# Altium schematic sheet Top.SchDoc
size B; SheetNumber: 1; SheetTotal: 7
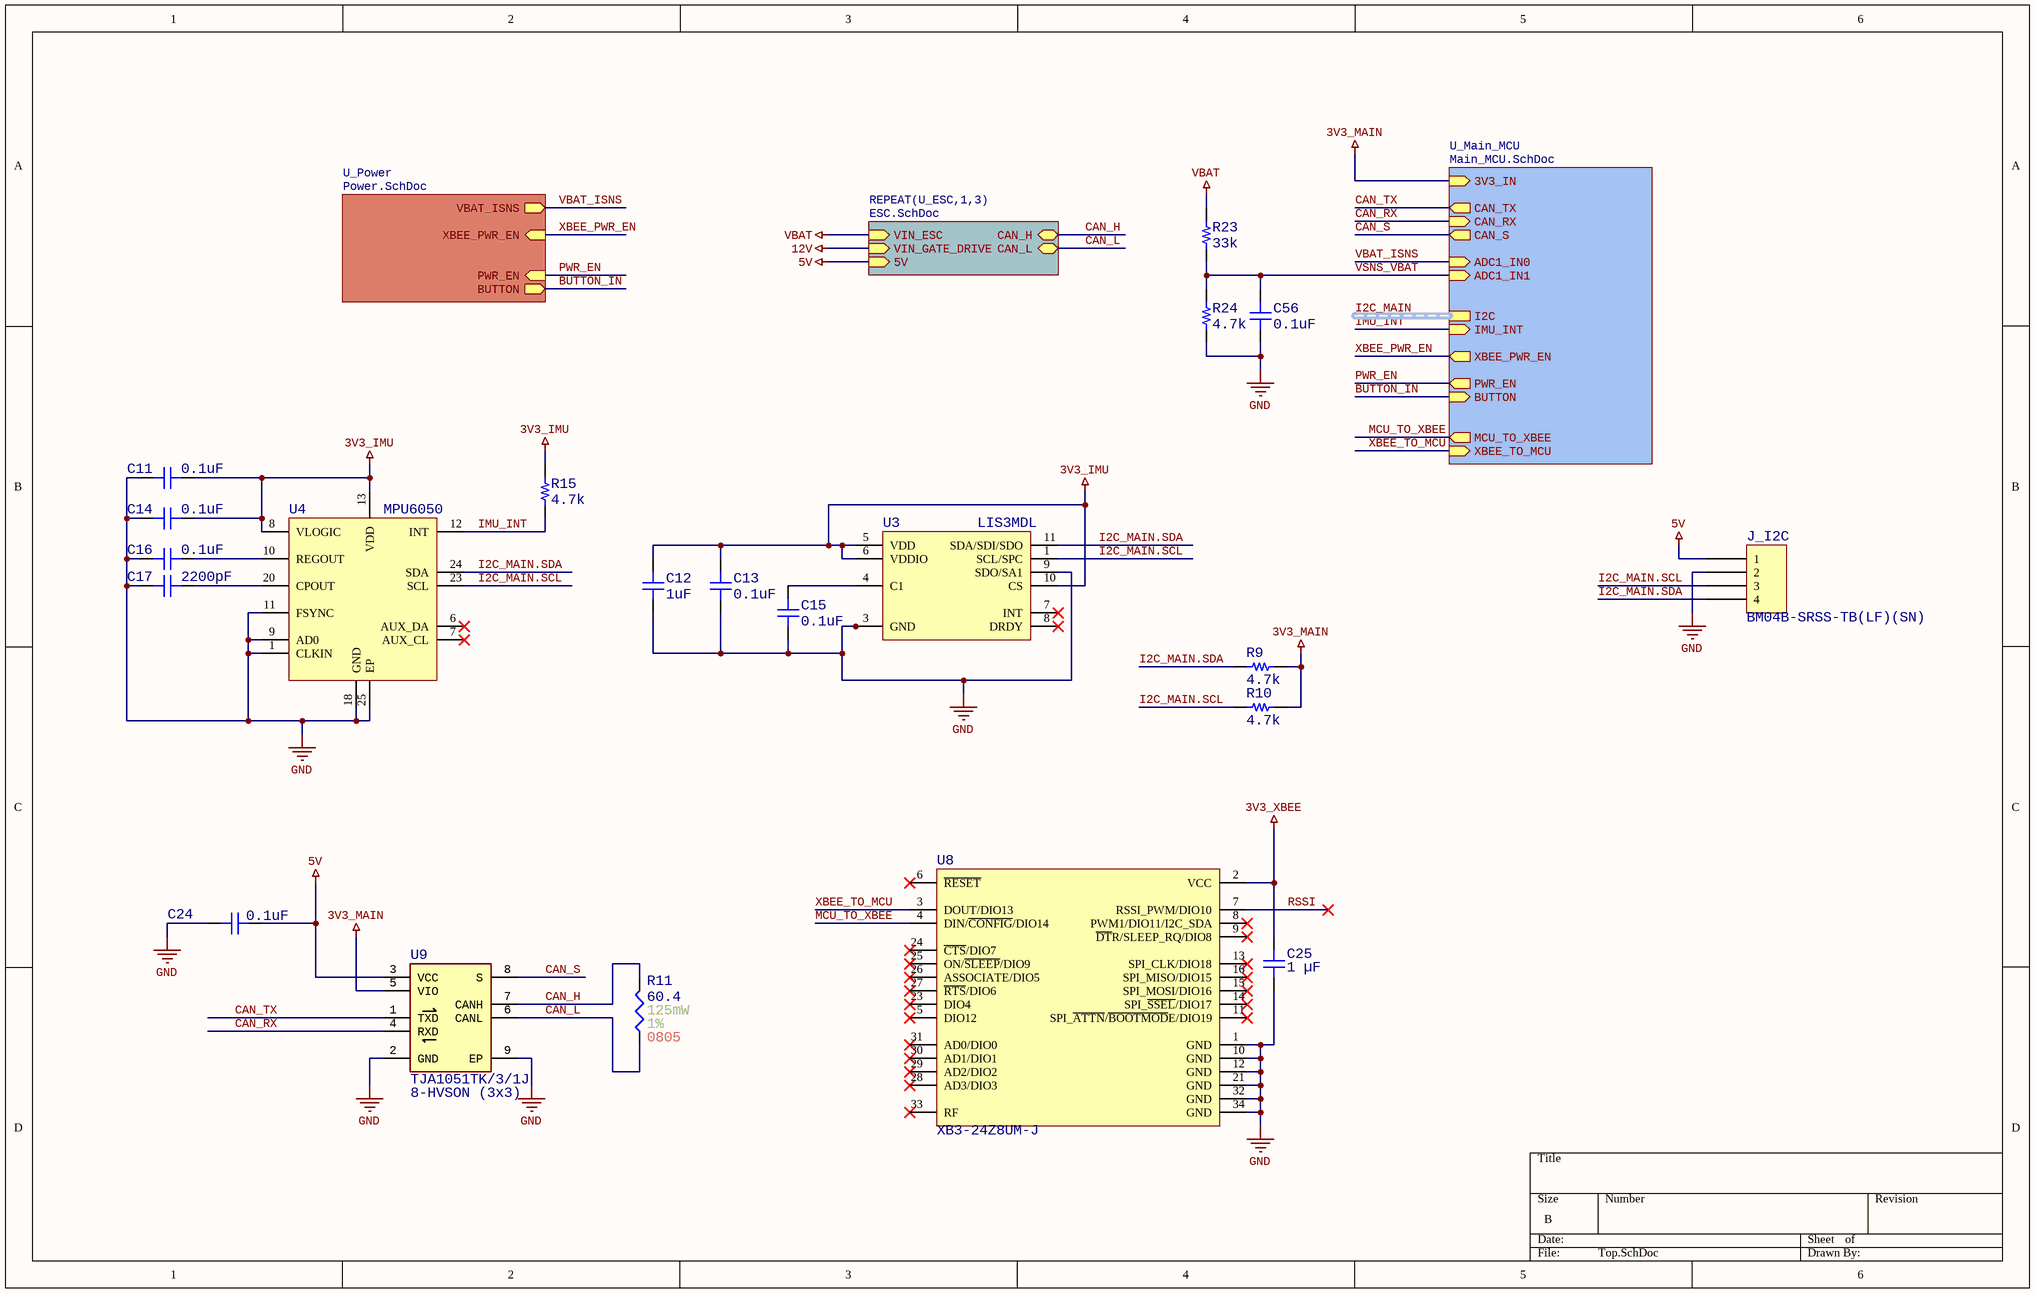
[diagram p0: Top.SchDoc]

## Parts
C11  0.1uF  [CAP_0402]
C12  1uF  [CAP_0402]
C13  0.1uF  [CAP_0402]
C14  0.1uF  [CAP_0402]
C15  0.1uF  [CAP_0402]
C16  0.1uF  [CAP_0402]
C17  2200pF  [CAP_0402]
C24  0.1uF  [CAP_0402]
C25  1 µF  [CAP 0402_1005]
C56  0.1uF  [CAP_0402]
J_I2C  BM04B-SRSS-TB(LF)(SN)  [JST BM04B-SRSS-TB]
R9  4.7k  [RES_0402]
R10  4.7k  [RES_0402]
R11  value 60.4  Power: 125mW  Tolerance: 1%  Case/Package: 0805  [0805 Resistor]  (hidden comment: TFA0805R60R4F-T5)
R15  4.7k  [RES_0402]
R23  33k  [RES_0402]
R24  4.7k  [RES_0402]
U3  LIS3MDL  [LGA12_ST]
U4  MPU6050  [IC_MPU6050]
U8  XB3-24Z8UM-J  [XCVR_XB3-24Z8UM-J]
U9  TJA1051TK/3/1J  Case/Package: 8-HVSON (3x3)  [TJA1044xxK]

## Sub-sheets
REPEAT(U_ESC,1,3) = ESC.SchDoc: CAN_H (bidir), CAN_L (bidir), VIN_ESC (in), VIN_GATE_DRIVE (in), 5V (in)
U_Main_MCU = Main_MCU.SchDoc: I2C (harness I2C), CAN_TX (out), CAN_RX (in), CAN_S (out), 3V3_IN (in), ADC1_IN0 (in), IMU_INT (in), XBEE_PWR_EN (out), PWR_EN (out), BUTTON (in), XBEE_TO_MCU (in), MCU_TO_XBEE (out), ADC1_IN1 (in)
U_Power = Power.SchDoc: XBEE_PWR_EN (in), VBAT_ISNS (out), PWR_EN (in), BUTTON (out)

## Nets
3V3_IMU: C11.1 C12.1 C13.1 C14.1 R15.1 U3.5(VDD) U3.6(VDDIO) U3.10(CS) U4.8(VLOGIC) U4.13(VDD)
3V3_MAIN: R9.1 R10.1 U9.5(VIO) ; sheet U_Main_MCU/3V3_IN
3V3_XBEE: C25.1 U8.2(VCC)
5V: C24.1 J_I2C.1 U9.3(VCC) ; sheet REPEAT(U_ESC,1,3)/5V
12V: sheet REPEAT(U_ESC,1,3)/VIN_GATE_DRIVE
GND: C11.2 C12.2 C13.2 C14.2 C15.2 C16.2 C17.2 C24.2 C25.2 C56.2 J_I2C.2 R24.2 U3.2(Reserved) U3.3(GND) U3.9(SDO/SA1) U3.12(Reserved) U4.1(CLKIN) U4.9(AD0) U4.11(FSYNC) U4.18(GND) U4.25(EP) U8.1(GND) U8.10(GND) U8.12(GND) U8.21(GND) U8.32(GND) U8.34(GND) U9.2(GND) U9.9(EP)
VBAT: R23.1 ; sheet REPEAT(U_ESC,1,3)/VIN_ESC
BUTTON_IN: sheet U_Main_MCU/BUTTON, sheet U_Power/BUTTON
CAN_H: R11.2 U9.7(CANH) ; sheet REPEAT(U_ESC,1,3)/CAN_H
CAN_L: R11.1 U9.6(CANL) ; sheet REPEAT(U_ESC,1,3)/CAN_L
CAN_RX: U9.4(RXD) ; sheet U_Main_MCU/CAN_RX
CAN_S: U9.8(S) ; sheet U_Main_MCU/CAN_S
CAN_TX: U9.1(TXD) ; sheet U_Main_MCU/CAN_TX
I2C_MAIN.SCL: J_I2C.3 R10.2 U3.1(SCL/SPC) U4.23(SCL)
I2C_MAIN.SDA: J_I2C.4 R9.2 U3.11(SDA/SDI/SDO) U4.24(SDA)
IMU_INT: R15.2 U4.12(INT) ; sheet U_Main_MCU/IMU_INT
MCU_TO_XBEE: U8.4(DIN/~{CONFIG}/DIO14) ; sheet U_Main_MCU/MCU_TO_XBEE
PWR_EN: sheet U_Main_MCU/PWR_EN, sheet U_Power/PWR_EN
RSSI: U8.7(RSSI_PWM/DIO10)
VBAT_ISNS: sheet U_Main_MCU/ADC1_IN0, sheet U_Power/VBAT_ISNS
VSNS_VBAT: C56.1 R23.2 R24.1 ; sheet U_Main_MCU/ADC1_IN1
XBEE_PWR_EN: sheet U_Main_MCU/XBEE_PWR_EN, sheet U_Power/XBEE_PWR_EN
XBEE_TO_MCU: U8.3(DOUT/DIO13) ; sheet U_Main_MCU/XBEE_TO_MCU
NetC15_1: C15.1 U3.4(C1)
NetC16_1: C16.1 U4.10(REGOUT)
NetC17_1: C17.1 U4.20(CPOUT)

Not connected (* = marked no-connect by the designer): U3 7(INT)* 8(DRDY)*; U4 6(AUX_DA)* 7(AUX_CL)*; U8 5(DIO12)* 6(~{RESET})* 8(PWM1/DIO11/I2C_SDA)* 9(~{DT}R/SLEEP_RQ/DIO8)* 11(SPI_~{ATTN}/~{BOOTMOD}E/DIO19)* 13(SPI_CLK/DIO18)* 14(SPI_~{SSEL}/DIO17)* 15(SPI_MOSI/DIO16)* 16(SPI_MISO/DIO15)* 23(DIO4)* 24(~{CTS}/DIO7)* 25(ON/~{SLEEP}/DIO9)* 26(ASSOCIATE/DIO5)* 27(~{RTS}/DIO6)* 28(AD3/DIO3)* 29(AD2/DIO2)* 30(AD1/DIO1)* 31(AD0/DIO0)* 33(RF)*

## Buses and harness runs
harness I2C_MAIN = sheet U_Main_MCU/I2C

## Library data of the parts
C11-C17 C24 C56 = CAP_0402: CAP CER 402
  C11 C13-C16 C24 C56: Value: 0.1uF
  C12: Value: 1uF
  C17: Value: 2200pF
C25 = C0402C104K4RACAUTO: CAP CER 0.1UF 16V X7R 0402; manufacturer: KEMET; Capacitance: 0.1 µF; Tolerance: ±10%; Part Number: C0402C104K4RACAUTO; Value: 1 µF; Applications: Automotive, Bypass, Decoupling; componentlink1description: Datasheet; componentlink1url: https://api.kemet.com/component-edge/download/specsheet/C0402C104K4RACAUTO.pdf; componentlink2description: DigiKey Link; componentlink2url: https://www.digikey.com/en/products/detail/kemet/C0402C104K4RACAUTO/3314827; Device Package: 0402 (1005 Metric); lastupdated: 8/14/2022 9:05:51 PM; Lifecycle Status: Active; Minimum Order: 1; Mounting Type: Surface Mount, MLCC; Operating Temperature: -55°C ~ 125°C; Package / Case: 0402 (1005 Metric); packaging: TapeAndReel; partid: 3024; Part Status: Active; price: 0.01; Ratings: AEC-Q200; series: SMD Auto X7R; Size / Dimension: 0.039" L x 0.020" W (1.00mm x 0.50mm); Supplier 1: DigiKey; Supplier Part Number 1: 399-6828-1-ND; Temperature Coefficient: X7R; Thickness (Max): 0.022" (0.55mm); Voltage - Rated: 16V
J_I2C = BM04B-SRSS-TB(LF)(SN): CONN HEADER SMD 4POS 1MM; Manufacturer: JST Sales America Inc.; Current Rating (Amps): 0.7A; Material Flammability Rating: UL94 V-0; Number of Positions: 4; Number of Positions Loaded: All; Pitch - Mating: 0.039" (1.00mm); Row Spacing - Mating: -25°C ~ 85°C; Shrouding: Shrouded - 4 Wall; Style: Board to Cable/Wire; Voltage Rating: 50V; Part Number: BM04B-SRSS-TB(LF)(SN); ComponentLink1Description: Datasheet; ComponentLink1URL: http://www.jst-mfg.com/product/pdf/eng/eSH.pdf; ComponentLink2Description: DigiKey Link; ComponentLink2URL: http://digikey.com/product-detail/en/jst-sales-america-inc/BM04B-SRSS-TB-LF-SN/455-1790-1-ND/926861; Connector Type: Header; Contact Finish - Mating: Tin; Contact Finish - Post: Tin; Contact Material: Copper Alloy; Contact Shape: Square; Contact Type: Male Pin; Fastening Type: Push-Pull; Features: Solder Retention; Insulation Color: Natural; Insulation Height: 0.167" (4.25mm); Insulation Material: Polyamide (PA), Nylon; LastUpdated: 8/24/2020 1:45:53 PM; Lifecycle Status: Active; Minimum Order: 1; Mounting Type: Surface Mount; Number of Rows: 1; Operating Temperature: -25°C ~ 85°C; Packaging: TapeAndReel; PartId: 16; Part Status: Active; Price: 0.29; Series: SR; Supplier 1: DigiKey; Supplier Part Number 1: 455-1790-1-ND; Termination: Solder
R9 R10 R15 R23 R24 = RES_0402: RES 0402
R11 = CMP-009-00189-2: Res 60.4 Ohm 1% 1/8W 0805; AECQ: Yes; Manufacturer Part Number: TFA0805R60R4F-T5; Mounting Technology: SMD; Pins: 2
U3 = LIS3MDL: Magnetometer
U8 = XB3-24Z8UM-J: 802.15.4 Zigbee Transceiver Module 2.4GHz Antenna Not Included, U.FL Surface Mount; MF: Digi International; Availability: Unavailable; MP: XB3-24Z8UM-J; Value: *; SnapEDA_Link: https://www.snapeda.com/parts/XB3-24Z8UM-J/Digi%20International/view-part/2762908/?ref=snap; Price: None; Package: SMD-34 Digi International
U9 = CMP-031-00007-3: Interface Circuit, PDSO8; AECQ: Yes; Max Operating Temperature: 150°C; Pins: 8; Min Operating Temperature: -40°C